# EAGLE design Signal_processing (EAGLE 9.5.1)
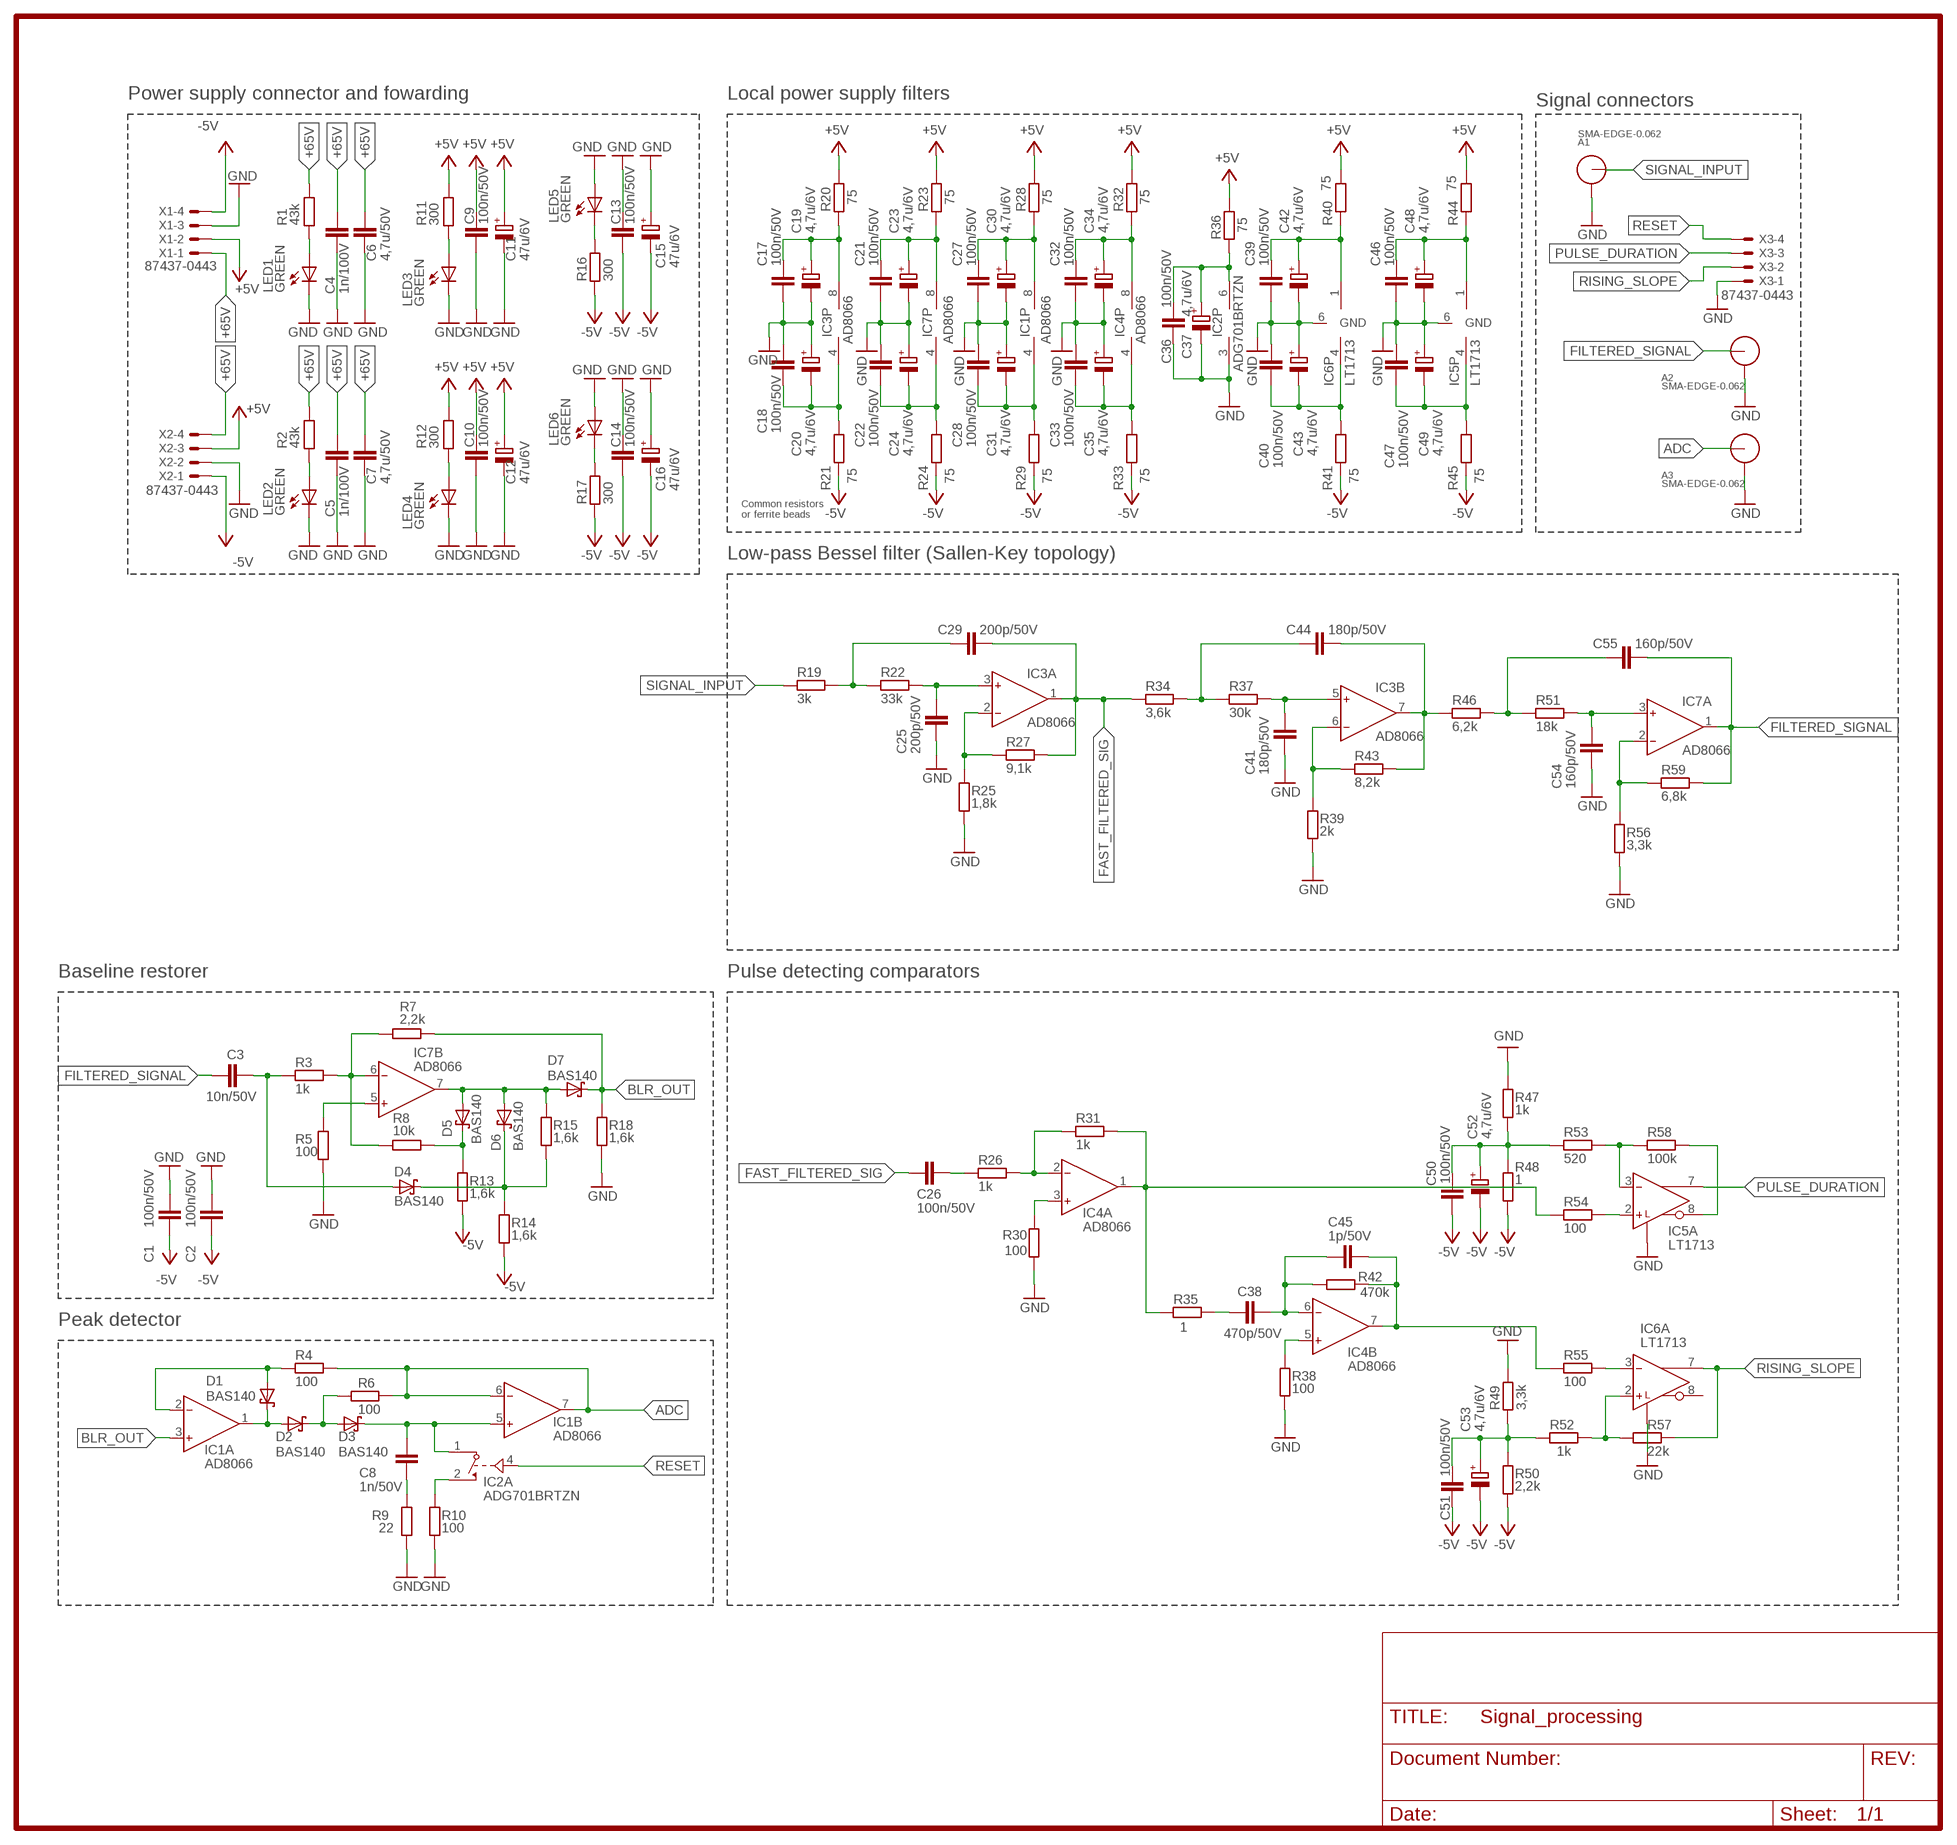
[diagram p0: schematic, sheet 1]

## Parts
A1  SMA-EDGE-0.062  LINX-SMA-EDGE-0.062  [CONSMA003.062]
A2  SMA-EDGE-0.062  LINX-SMA-EDGE-0.062  [CONSMA003.062]
A3  SMA-EDGE-0.062  LINX-SMA-EDGE-0.062  [CONSMA003.062]
C1  100n/50V  C-EUC0603  [C0603]
C2  100n/50V  C-EUC0603  [C0603]
C3  10n/50V  C-EUC0603  [C0603]
C4  1n/100V  C-EUC0603  [C0603]
C5  1n/100V  C-EUC0603  [C0603]
C6  4,7u/50V  C-EUC1206  [C1206]
C7  4,7u/50V  C-EUC1206  [C1206]
C8  1n/50V  C-EUC0603  [C0603]
C9  100n/50V  C-EUC0603  [C0603]
C10  100n/50V  C-EUC0603  [C0603]
C11  47u/6V  CPOL-EUSMCB  [SMC_B]
C12  47u/6V  CPOL-EUSMCB  [SMC_B]
C13  100n/50V  C-EUC0603  [C0603]
C14  100n/50V  C-EUC0603  [C0603]
C15  47u/6V  CPOL-EUSMCB  [SMC_B]
C16  47u/6V  CPOL-EUSMCB  [SMC_B]
C17  100n/50V  C-EUC0603  [C0603]
C18  100n/50V  C-EUC0603  [C0603]
C19  4,7u/6V  CPOL-EUSMCA  [SMC_A]
C20  4,7u/6V  CPOL-EUSMCA  [SMC_A]
C21  100n/50V  C-EUC0603  [C0603]
C22  100n/50V  C-EUC0603  [C0603]
C23  4,7u/6V  CPOL-EUSMCA  [SMC_A]
C24  4,7u/6V  CPOL-EUSMCA  [SMC_A]
C25  200p/50V  C-EUC0603  [C0603]
C26  100n/50V  C-EUC0603  [C0603]
C27  100n/50V  C-EUC0603  [C0603]
C28  100n/50V  C-EUC0603  [C0603]
C29  200p/50V  C-EUC0603  [C0603]
C30  4,7u/6V  CPOL-EUSMCA  [SMC_A]
C31  4,7u/6V  CPOL-EUSMCA  [SMC_A]
C32  100n/50V  C-EUC0603  [C0603]
C33  100n/50V  C-EUC0603  [C0603]
C34  4,7u/6V  CPOL-EUSMCA  [SMC_A]
C35  4,7u/6V  CPOL-EUSMCA  [SMC_A]
C36  100n/50V  C-EUC0603  [C0603]
C37  4,7u/6V  CPOL-EUSMCA  [SMC_A]
C38  470p/50V  C-EUC0603  [C0603]
C39  100n/50V  C-EUC0603  [C0603]
C40  100n/50V  C-EUC0603  [C0603]
C41  180p/50V  C-EUC0603  [C0603]
C42  4,7u/6V  CPOL-EUSMCA  [SMC_A]
C43  4,7u/6V  CPOL-EUSMCA  [SMC_A]
C44  180p/50V  C-EUC0603  [C0603]
C45  1p/50V  C-EUC0603  [C0603]
C46  100n/50V  C-EUC0603  [C0603]
C47  100n/50V  C-EUC0603  [C0603]
C48  4,7u/6V  CPOL-EUSMCA  [SMC_A]
C49  4,7u/6V  CPOL-EUSMCA  [SMC_A]
C50  100n/50V  C-EUC0603  [C0603]
C51  100n/50V  C-EUC0603  [C0603]
C52  4,7u/6V  CPOL-EUSMCA  [SMC_A]
C53  4,7u/6V  CPOL-EUSMCA  [SMC_A]
C54  160p/50V  C-EUC0603  [C0603]
C55  160p/50V  C-EUC0603  [C0603]
D1  BAS140  [SOD2514X100N]
D2  BAS140  [SOD2514X100N]
D3  BAS140  [SOD2514X100N]
D4  BAS140  [SOD2514X100N]
D5  BAS140  [SOD2514X100N]
D6  BAS140  [SOD2514X100N]
D7  BAS140  [SOD2514X100N]
IC1  AD8066  [MSOP8]
IC2  ADG701BRTZN  [SOT23-6]
IC3  AD8066  [MSOP8]
IC4  AD8066  [MSOP8]
IC5  LT1713  [MSOP8]
IC6  LT1713  [MSOP8]
IC7  AD8066  [MSOP8]
LED1  GREEN  LEDCHIPLED_0603  [CHIPLED_0603]
LED2  GREEN  LEDCHIPLED_0603  [CHIPLED_0603]
LED3  GREEN  LEDCHIPLED_0603  [CHIPLED_0603]
LED4  GREEN  LEDCHIPLED_0603  [CHIPLED_0603]
LED5  GREEN  LEDCHIPLED_0603  [CHIPLED_0603]
LED6  GREEN  LEDCHIPLED_0603  [CHIPLED_0603]
R1  43k  R-EU_R0603  [R0603]
R2  43k  R-EU_R0603  [R0603]
R3  1k  R-EU_R0603  [R0603]
R4  100  R-EU_R0603  [R0603]
R5  100  R-EU_R0603  [R0603]
R6  100  R-EU_R0603  [R0603]
R7  2,2k  R-EU_R0603  [R0603]
R8  10k  R-EU_R0603  [R0603]
R9  22  R-EU_R0603  [R0603]
R10  100  R-EU_R0603  [R0603]
R11  300  R-EU_R0603  [R0603]
R12  300  R-EU_R0603  [R0603]
R13  1,6k  R-EU_R0603  [R0603]
R14  1,6k  R-EU_R0603  [R0603]
R15  1,6k  R-EU_R0603  [R0603]
R16  300  R-EU_R0603  [R0603]
R17  300  R-EU_R0603  [R0603]
R18  1,6k  R-EU_R0603  [R0603]
R19  3k  R-EU_R0603  [R0603]
R20  75  R-EU_R0603  [R0603]
R21  75  R-EU_R0603  [R0603]
R22  33k  R-EU_R0603  [R0603]
R23  75  R-EU_R0603  [R0603]
R24  75  R-EU_R0603  [R0603]
R25  1,8k  R-EU_R0603  [R0603]
R26  1k  R-EU_R0603  [R0603]
R27  9,1k  R-EU_R0603  [R0603]
R28  75  R-EU_R0603  [R0603]
R29  75  R-EU_R0603  [R0603]
R30  100  R-EU_R0603  [R0603]
R31  1k  R-EU_R0603  [R0603]
R32  75  R-EU_R0603  [R0603]
R33  75  R-EU_R0603  [R0603]
R34  3,6k  R-EU_R0603  [R0603]
R35  1  R-EU_R0603  [R0603]
R36  75  R-EU_R0603  [R0603]
R37  30k  R-EU_R0603  [R0603]
R38  100  R-EU_R0603  [R0603]
R39  2k  R-EU_R0603  [R0603]
R40  75  R-EU_R0603  [R0603]
R41  75  R-EU_R0603  [R0603]
R42  470k  R-EU_R0603  [R0603]
R43  8,2k  R-EU_R0603  [R0603]
R44  75  R-EU_R0603  [R0603]
R45  75  R-EU_R0603  [R0603]
R46  6,2k  R-EU_R0603  [R0603]
R47  1k  R-EU_R0603  [R0603]
R48  1  R-EU_R0603  [R0603]
R49  3,3k  R-EU_R0603  [R0603]
R50  2,2k  R-EU_R0603  [R0603]
R51  18k  R-EU_R0603  [R0603]
R52  1k  R-EU_R0603  [R0603]
R53  520  R-EU_R0603  [R0603]
R54  100  R-EU_R0603  [R0603]
R55  100  R-EU_R0603  [R0603]
R56  3,3k  R-EU_R0603  [R0603]
R57  22k  R-EU_R0603  [R0603]
R58  100k  R-EU_R0603  [R0603]
R59  6,8k  R-EU_R0603  [R0603]
X1  87437-0443  87438-0487437-0443  [87437-0443]
X2  87437-0443  87438-0487437-0443  [87437-0443]
X3  87437-0443  87438-0487437-0443  [87437-0443]

## Nets
+5V: C9.2 C10.2 C11.+ C12.+ R11.2 R12.2 R20.1 R23.1 R28.1 R32.1 R36.1 R40.1 R44.1 X1.2 X1.6 X2.3 X2.7
+65V: C4.2 C5.2 C6.1 C7.1 R1.2 R2.2 X1.1 X1.5 X2.4 X2.8
-5V: C1.1 C2.1 C13.1 C14.1 C15.- C16.- C50.2 C51.2 C52.- C53.- R13.2 R14.2 R16.1 R17.1 R21.2 R24.2 R29.2 R33.2 R41.2 R45.2 R48.2 R50.2 X1.4 X1.8 X2.1 X2.5
ADC: A3.ANT IC1.6(B:IN-) IC1.7(B:OUT) R4.2 R6.2
BLR_OUT: D7.K IC1.3(A:IN+) R7.1 R18.1
FAST_FILTERED_SIG: C26.2 C29.1 IC3.1(A:OUT) R27.2 R34.1
FILTERED_SIGNAL: A2.ANT C3.2 C55.1 IC7.1(A:OUT) R59.2
GND: A1.GND1 A1.GND2 A1.GND3 A1.GND4 A2.GND1 A2.GND2 A2.GND3 A2.GND4 A3.GND1 A3.GND2 A3.GND3 A3.GND4 C1.2 C2.2 C4.1 C5.1 C6.2 C7.2 C9.1 C10.1 C11.- C12.- C13.2 C14.2 C15.+ C16.+ C17.1 C18.2 C19.- C20.+ C21.1 C22.2 C23.- C24.+ C25.1 C27.1 C28.2 C30.- C31.+ C32.1 C33.2 C34.- C35.+ C36.1 C37.- C39.1 C40.2 C41.1 C42.- C43.+ C46.1 C47.2 C48.- C49.+ C54.1 IC2.3(P:V-) IC5.5(A:L) IC5.6(GND:GND) IC6.5(A:L) IC6.6(GND:GND) LED1.C LED2.C LED3.C LED4.C LED5.A LED6.A R5.1 R9.1 R10.1 R18.2 R25.1 R30.1 R38.1 R39.1 R47.1 R49.1 R56.1 X1.3 X1.7 X2.2 X2.6 X3.1 X3.5
N$1: LED3.A R11.1
N$2: LED5.C R16.2
N$3: LED2.A R2.1
N$4: C18.1 C20.- IC3.4(P:V-) R21.1
N$5: LED4.A R12.1
N$6: C22.1 C24.- IC7.4(P:V-) R24.1
N$7: LED6.C R17.2
N$10: C29.2 R19.2 R22.1
N$11: C3.1 D4.A R3.1
N$12: IC7.6(B:IN-) R3.2 R7.2 R8.2
N$13: D5.A D6.A D7.A IC7.7(B:OUT) R15.1
N$14: D1.K D2.A IC1.1(A:OUT)
N$15: C25.2 IC3.3(A:IN+) R22.2
N$16: IC3.2(A:IN-) R25.2 R27.1
N$17: C27.2 C30.+ IC1.8(P:V+) R28.2
N$18: C21.2 C23.+ IC7.8(P:V+) R23.2
N$19: C44.2 R34.2 R37.1
N$20: D5.K R8.1 R13.1
N$21: C28.1 C31.- IC1.4(P:V-) R29.1
N$22: D4.K D6.K R14.1 R15.2
N$23: D1.A IC1.2(A:IN-) R4.1
N$24: C55.2 R46.2 R51.1
N$25: D2.K D3.A R6.1
N$26: IC7.5(B:IN+) R5.2
N$27: LED1.A R1.1
N$28: IC4.2(A:IN-) R26.2 R31.1
N$31: C8.1 D3.K IC1.5(B:IN+) IC2.1(A:D)
N$32: C41.2 IC3.5(B:IN+) R37.2
N$33: IC3.6(B:IN-) R39.2 R43.1
N$35: C8.2 R9.2
N$36: C54.2 IC7.3(A:IN+) R51.2
N$38: C17.2 C19.+ IC3.8(P:V+) R20.2
N$39: C36.2 C37.+ IC2.6(P:V+) R36.2
N$40: IC2.2(A:S) R10.2
N$41: C26.1 R26.1
N$42: C39.2 C42.+ IC6.1(P:V+) R40.2
N$43: IC4.5(B:IN+) R38.2
N$44: C40.1 C43.- IC6.4(P:V-) R41.1
N$45: C46.2 C48.+ IC5.1(P:V+) R44.2
N$46: C47.1 C49.- IC5.4(P:V-) R45.1
N$49: IC7.2(A:IN-) R56.2 R59.1
N$51: IC4.1(A:OUT) R31.2 R35.1 R54.1
N$52: IC4.3(A:IN+) R30.2
N$53: C38.2 R35.2
N$54: C38.1 C45.2 IC4.6(B:IN-) R42.1
N$55: C45.1 IC4.7(B:OUT) R42.2 R55.1
N$56: IC5.2(A:IN+) R54.2
N$57: IC6.2(A:IN+) R52.2 R57.1
N$58: C51.1 C53.+ R49.2 R50.1 R52.1
N$59: IC5.3(A:IN-) R53.2 R58.1
N$60: IC5.8(A:BOUT) R58.2
N$61: IC6.3(A:IN-) R55.2
N$62: C32.2 C34.+ IC4.8(P:V+) R32.2
N$63: C50.1 C52.+ R47.2 R48.1 R53.1
N$64: C33.1 C35.- IC4.4(P:V-) R33.1
N$99: C44.1 IC3.7(B:OUT) R43.2 R46.1
PULSE_DURATION: IC5.7(A:OUT) X3.3 X3.7
RESET: IC2.4(A:IN) X3.4 X3.8
RISING_SLOPE: IC6.7(A:OUT) R57.2 X3.2 X3.6
SIGNAL_INPUT: A1.ANT R19.1
Unconnected: IC6.8(A:BOUT)

## Notes on the sheet
- Power supply connector and fowarding | Local power supply filters
- Signal connectors
- Common resistors 
  or ferrite beads
- Low-pass Bessel filter (Sallen-Key topology)
- Baseline restorer | Pulse detecting comparators
- Peak detector

## Library data of the parts
A1-A3 = connector:LINX-SMA-EDGE-0.062: CONN SMA JACK 50 OHM EDGE MNT; DIGIKEY: CONSMA003.062-ND
C1-C3 C6-C10 C13 C14 C17 C18 C21 C22 C25-C29 C32 C33 C36 C38-C41 C44-C47 C50 C51 C54 C55 = rcl:C-EU: CAPACITOR, European symbol; SPICEPREFIX: C
C4 C5 = rcl:C-EU: CAPACITOR, European symbol
C11 C12 C15 C16 C19 C20 C23 C24 C30 C31 C34 C35 C37 C42 C43 C48 C49 C52 C53 = rcl:CPOL-EU: POLARIZED CAPACITOR, European symbol; SPICEPREFIX: C
D1-D7 = NXP_60_26022015:BAS140
IC1 IC3 IC4 IC7 = analog-devices:AD8066: High Performance, 145 MHz FastFET Op Amps Source: http://www.analog.com/static/imported-files/data_sheets/AD8065_8066.pdf
IC2 = ADG701BRTZ:ADG701BRTZ: ADG701BRTZ, Analogue SPST Switch Single SPST, 3, 5V, 6-Pin, SOT-23 Source: Datasheet <http://www.analog.com/static/imported-files/data_sheets/ADG701_702.pdf>
IC5 IC6 = analog-devices:LT1713
LED1-LED6 = led:LED: LED OSRAM: - CHIPLED LG R971, LG N971, LY N971, LG Q971, LY Q971, LO R971, LY R971 LH N974, LH R974 LS Q976, LO Q976, LY Q976 LO Q996 - Hyper CHIPLED LW Q18S LB Q993, LB Q99A, LB R99A - SideLED LS A670, LO A670, LY A670, LG A670, LP A670 LB A673, LV A673, LT A673, LW A673 LH A674 LY A675 LS A676, LA A676, LO A676, LY A676, LW A676 LS A679, LY A679, LG A679 - Hyper Micro SIDELED® LS Y876, LA Y876, LO Y876, LY Y876 LT Y87S - SmartLED LW L88C, LW L88S LB L89C, LB L89S, LG L890 LS L89K, LO L89K, LY L89K LS L896, LA L896, LO L896, LY L896 - TOPLED LS T670, LO T670, LY T670, LG T670, LP T670 LSG T670, LSP T670, LSY T670, LOP T670, LYG T670 LG T671, LOG T671, LSG T671 LB T673, LV T673, LT T673, LW T673 LH T674 LS T676, LA T676, LO T676, LY T676, LB T676, LH T676, LSB T676, LW T676 LB T67C, LV T67C, LT T67C, LS T67K, LO T67K, LY T67K, LW E67C LS E67B, LA E67B, LO E67B, LY E67B, LB E67C, LV E67C, LT E67C LW T67C LS T679, LY T679, LG T679 LS T770, LO T770, LY T770, LG T770, LP T770 LB T773, LV T773, LT T773, LW T773 LH T774 LS E675, LA E675, LY E675, LS T675 LS T776, LA T776, LO T776, LY T776, LB T776 LHGB T686 LT T68C, LB T68C - Hyper Mini TOPLED® LB M676 - Mini TOPLED Santana® LG M470 LS M47K, LO M47K, LY M47K Source: http://www.osram.convergy.de LUXEON: - LUMILED® LXK2-PW12-R00, LXK2-PW12-S00, LXK2-PW14-U00, LXK2-PW14-V00 LXK2-PM12-R00, LXK2-PM12-S00, LXK2-PM14-U00 LXK2-PE12-Q00, LXK2-PE12-R00, LXK2-PE12-S00, LXK2-PE14-T00, LXK2-PE14-U00 LXK2-PB12-K00, LXK2-PB12-L00, LXK2-PB12-M00, LXK2-PB14-N00, LXK2-PB14-P00, LXK2-PB14-Q00 LXK2-PR12-L00, LXK2-PR12-M00, LXK2-PR14-Q00, LXK2-PR14-R00 LXK2-PD12-Q00, LXK2-PD12-R00, LXK2-PD12-S00 LXK2-PH12-R00, LXK2-PH12-S00 LXK2-PL12-P00, LXK2-PL12-Q00, LXK2-PL12-R00 Source: www.luxeon.com KINGBRIGHT: KA-3528ASYC Source: www.kingbright.com
R1-R59 = rcl:R-EU_: RESISTOR, European symbol; SPICEPREFIX: R
X1-X3 = con-molex:87438-04: Wire-to-Board 1.50mm (.059") Pitch Header - Right Angle, SMT, Shrouded Source: http://www.molex.com/product/micro/87438.html

## Board
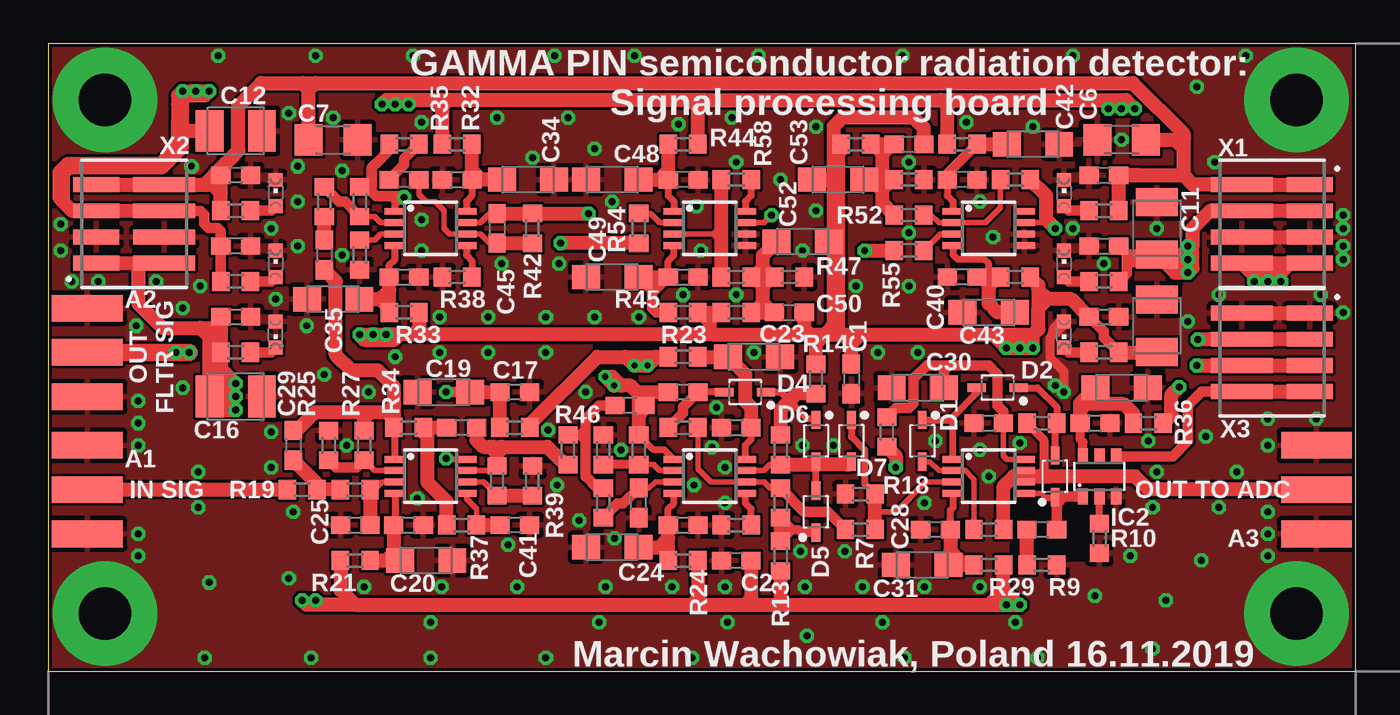
[diagram p1: board, top side]
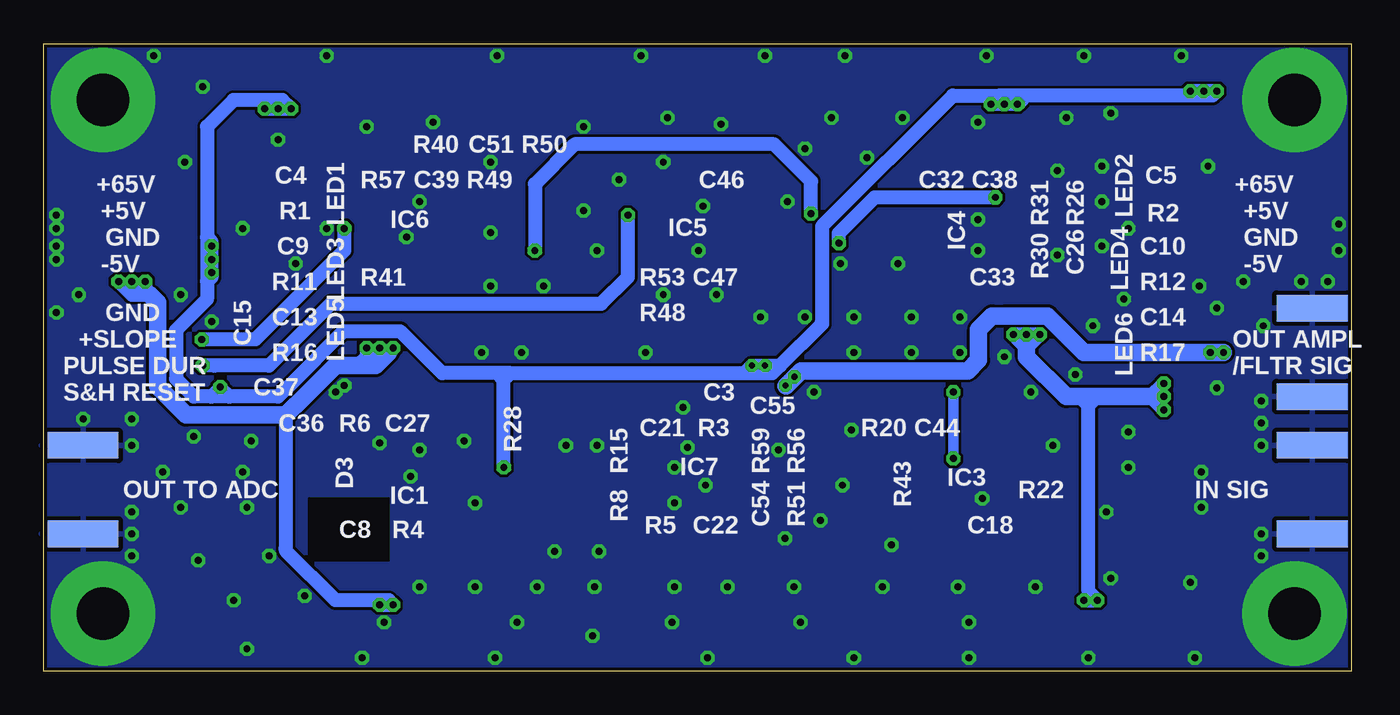
[diagram p2: board, bottom side, seen from below]

Size 75 x 36 mm. Coordinates in mm from the lower left corner, seen from the top.
Outline: 0,0 75,0 75,36 0,36 0,0
Copper layers (1*16): Top 0.035mm / dielectric 1.5mm / Bottom 0.035mm
Design rules "JLCPCB *": minimum track width 6mil, minimum drill 0.2mm, track to track 6mil, track to pad 6mil, pad to pad 6mil, via to via 6mil, smd to smd 6mil, copper to edge 8mil, drill to drill 6mil, minimum pad ring 10mil, minimum via ring 8mil, stop-mask expansion 4mil, vias tented up to drill 20mil, thermal gap 10mil

### Footprints (pad centres in the part's own frame; a part is rotated, then mirrored left to right if it is on the bottom)
CONSMA003.062 = smd 4.06 x 1.52: ANT 0,0; GND1 0,2.54; GND2 0,-2.54 | smd 4.06 x 1.52 bottom: GND3 0,2.54; GND4 0,-2.54
C0603 = smd 1.1 x 1: 1 -0.85,0; 2 0.85,0
C1206 = smd 1.6 x 1.8: 1 -1.4,0; 2 1.4,0
SMC_B = smd 1.6 x 2.4: + -1.5,0; - 1.5,0
SMC_A = smd 1.6 x 1.4: + -1.5,0; - 1.5,0
SOD2514X100N = smd 1.05 x 0.5: A 1.2,0; K -1.2,0
MSOP8 = smd 0.4 x 1.2: 1 -0.975,-2.05; 2 -0.325,-2.05; 3 0.325,-2.05; 4 0.975,-2.05; 5 0.975,2.05; 6 0.325,2.05; 7 -0.325,2.05; 8 -0.975,2.05
SOT23-6 = smd 0.6 x 0.9: 1 -0.95,-1.15; 2 0,-1.15; 3 0.95,-1.15; 4 0.95,1.15; 5 0,1.15; 6 -0.95,1.15
CHIPLED_0603 = smd 0.8 x 0.8: A 0,-0.75; C 0,0.75
R0603 = smd 1 x 1.1: 1 -0.85,0; 2 0.85,0
87437-0443 = smd 2.65 x 0.85: 1 0,2.25; 2 0,0.75; 3 0,-0.75; 4 0,-2.25 | smd 3.55 x 0.85: 5 -3.9,2.25; 6 -3.9,0.75; 7 -3.9,-0.75; 8 -3.9,-2.25

### Placement (x,y rotation side)
A1  2.25,10.41 0 top
A2  2.25,18.29 0 top
A3  72.74,10.41 0 top
C1  46.07,16.76 270 top
C2  39.46,6.35 180 top
C3  36.42,16 180 top
C4  60.55,28.45 0 top
C5  10.76,28.45 180 top
C6  61.56,30.48 180 top
C7  16.35,30.48 0 top
C8  56.99,8.13 180 top
C9  60.55,24.38 0 top
C10  10.76,24.38 180 top
C11  63.59,25.4 90 top
C12  10.76,30.99 0 top
C13  60.55,20.32 0 top
C14  10.76,20.32 0 top
C15  63.59,19.81 270 top
C16  10.76,15.75 180 top
C17  26.76,16 180 top
C18  20.67,8.38 0 top
C19  22.7,16 180 top
C20  21.68,6.35 180 top
C21  39.46,13.97 0 top
C22  36.42,8.38 0 top
C23  40.48,18.03 0 top
C24  32.35,7.11 0 top
C25  17.62,8.38 0 top
C26  15.84,23.88 270 top
C27  53.94,14.22 0 top
C28  50.89,8.13 180 top
C29  14.06,12.95 270 top
C30  49.88,16.26 180 top
C31  50.13,6.1 0 top
C32  23.46,28.19 0 top
C33  20.41,22.61 0 top
C34  27.53,28.19 0 top
C35  16.35,21.34 0 top
C36  60.04,14.22 180 top
C37  61.56,16.26 0 top
C38  20.41,28.19 180 top
C39  52.42,28.19 180 top
C40  52.42,22.61 180 top
C41  26.76,8.38 180 top
C42  56.48,30.23 0 top
C43  53.94,20.57 0 top
C44  23.72,13.97 180 top
C45  25.75,25.4 270 top
C46  36.42,28.19 180 top
C47  36.42,22.61 0 top
C48  32.35,28.19 180 top
C49  32.35,22.61 0 top
C50  42.51,20.57 0 top
C51  49.37,30.23 0 top
C52  43.27,24.64 0 top
C53  45.31,28.19 180 top
C54  33.88,9.65 90 top
C55  33.37,15.24 180 top
D1  50.13,13.21 270 top
D2  54.45,16.26 180 top
D3  57.75,11.18 90 top
D4  39.97,16 180 top
D5  44.04,9.14 90 top
D6  44.04,13.21 270 top
D7  46.07,13.21 270 top
IC1  53.94,11.18 270 top
IC2  60.29,11.18 0 top
IC3  21.94,11.18 270 top
IC4  21.94,25.4 270 top
IC5  37.94,25.4 270 top
IC6  53.94,25.4 270 top
IC7  37.94,11.18 270 top
LED1  58.26,27.43 0 top
LED2  13.05,27.43 0 top
LED3  58.26,23.37 0 top
LED4  13.05,23.37 0 top
LED5  58.26,19.3 180 top
LED6  13.05,19.3 180 top
R1  60.55,26.42 0 top
R2  10.76,26.42 180 top
R3  36.42,13.97 0 top
R4  53.94,8.13 0 top
R5  39.46,8.38 0 top
R6  56.99,14.22 180 top
R7  46.58,8.13 180 top
R8  42,9.65 90 top
R9  56.99,6.1 180 top
R10  60.29,7.62 90 top
R11  60.55,22.35 0 top
R12  10.76,22.35 180 top
R13  42,6.6 270 top
R14  44.04,16.76 90 top
R15  42,12.7 90 top
R16  60.55,18.29 180 top
R17  10.76,18.29 0 top
R18  46.58,10.16 180 top
R19  14.57,10.41 0 top
R20  1  [R0603]  26.76,13.97 180 top
R21  1  [R0603]  17.62,6.35 180 top
R22  17.62,10.41 0 top
R23  1  [R0603]  36.42,18.03 0 top
R24  1  [R0603]  36.42,6.35 0 top
R25  16.1,12.95 270 top
R26  15.84,26.92 90 top
R27  18.13,12.95 90 top
R28  1  [R0603]  48.1,13.72 90 top
R29  1  [R0603]  53.94,6.1 0 top
R30  17.87,23.88 90 top
R31  17.87,26.92 90 top
R32  1  [R0603]  23.46,30.23 0 top
R33  1  [R0603]  20.41,20.57 0 top
R34  20.67,13.97 0 top
R35  20.41,30.23 0 top
R36  1  [R0603]  63.09,14.22 180 top
R37  23.72,8.38 0 top
R38  23.46,22.61 0 top
R39  27.78,10.92 270 top
R40  1  [R0603]  52.42,30.23 0 top
R41  1  [R0603]  55.47,22.61 0 top
R42  27.78,25.4 90 top
R43  25.75,10.92 90 top
R44  1  [R0603]  36.42,30.23 180 top
R45  1  [R0603]  36.42,20.57 0 top
R46  29.81,12.7 90 top
R47  42.51,22.61 180 top
R48  39.46,20.57 180 top
R49  49.37,28.19 180 top
R50  46.32,30.23 180 top
R51  31.84,9.65 270 top
R52  49.37,26.16 0 top
R53  39.46,22.61 180 top
R54  33.88,25.4 90 top
R55  49.37,24.13 0 top
R56  31.84,12.7 270 top
R57  55.47,28.19 0 top
R58  39.46,28.19 0 top
R59  33.88,12.7 90 top
X1  72.36,25.65 0 top
X2  2.76,25.65 180 top
X3  72.36,18.29 0 top

### Tracks (layer width: path | path; a pad name or v marks a point on that pad's centre or on a via)
+5V  (via drill 0.35, 0.4)
  Top 0.61: R12.2 C10.2 9.91,25.23 9.74,25.41 9.22,25.41 8.96,25.68 8.96,26.19 8.74,26.4 X2.7 | 63.57,23.88 62.58,23.88 62.58,23.53 | C9.2 61.86,23.92 | 61.86,23.62 61.86,22.82 R11.2 | 61.86,23.62 61.86,23.92 | 61.86,23.92 61.88,23.9 C11.+ 63.15,23.46 62.03,23.46 61.86,23.62
  Top 0.813: R28.1 48.61,12.36 v48.61,11.68 | 37.69,32.77 36.85,32.77 | 36.85,32.77 22.95,32.77 | 22.95,32.77 22.27,32.77 | R44.1 37.27,32.35 | 37.27,32.35 37.69,32.77 | 37.27,32.35 36.85,32.77 | 7.46,30.48 7.46,29.97 | 7.46,30.48 7.46,31.5 | C12.+ 7.97,30.99 | 7.97,30.99 7.46,30.48 | 7.97,30.99 7.46,31.5 | R32.1 22.61,32.42 | 22.61,32.42 22.95,32.77 | 22.61,32.42 22.27,32.77 | 37.69,32.77 51.23,32.77 | 51.23,32.77 51.91,32.77 | R40.1 51.57,32.42 | 51.57,32.42 51.91,32.77 | 51.57,32.42 51.23,32.77 | C11.+ 64.13,23.9 | 68.47,26.42 66.64,26.42 | 63.57,23.88 C11.+ | R36.1 64.42,14.71 64.42,15.86 v64.86,16.3 | C11.+ 64.33,23.9 | C11.+ 65.09,23.9 65.09,23.14 v65.37,22.86 | C11.+ 64.63,22.86 v65.37,22.86 | 66.64,26.42 65.63,25.4 65.63,24.38 | C11.+ 65.14,23.9 65.63,24.38 | 66.65,26.4 66.64,26.42 | 51.91,32.77 61.82,32.77 v62.32,32.26 | 7.46,32.51 7.46,33.02 v7.71,33.27 | 7.46,32.51 7.46,31.5 | 22.27,32.77 19.4,32.77 v19.14,32.51 | v8.48,33.27 8.22,33.02 8.98,33.02 v9.24,33.27 v8.48,33.27 | 7.46,32.51 7.59,32.64 8.22,33.27 v8.48,33.27 | 0.76,27.2 0.76,27.03 1.39,26.4 X2.3 X2.7 | v65.37,22.86 65.63,23.11 65.63,24.38 | v65.37,24.38 v65.37,23.62 | 33.11,18.03 34.89,18.03 | 34.89,18.03 R23.1 | R20.1 27.71,14.06 27.71,14.24 31.5,18.03 33.11,18.03 | 33.11,18.03 v33.62,17.53 v34.38,17.53 34.89,18.03 | X1.6 68.47,26.42 | 68.47,26.42 68.67,26.42 | X1.2 68.48,26.4 68.47,26.42
  Top 1.016: 7.59,32.64 7.59,30.1 | 7.46,29.97 6.48,28.99 1.15,28.99 0.76,28.6 0.76,27.2
  Bottom 0.813: v62.32,32.26 v61.56,32.26 v60.8,32.26 61.31,32.77 64.1,32.77 65.63,31.24 65.63,24.89 | 18.89,33.02 7.97,33.02 v7.71,33.27 v9.24,33.27 | 18.89,33.02 18.89,32.77 v19.14,32.51 v19.91,32.51 v20.67,32.51 20.16,33.02 | 18.89,33.02 20.16,33.02 | 20.16,33.02 22.86,33.02 30.36,25.52 30.36,19.94 30.37,19.92 | 64.36,15.75 61.56,15.75 61,16.31 60.99,16.31 57.79,19.51 54.56,19.51 52.14,17.09 48.99,17.09 | 64.36,15.75 65.37,15.75 | 65.37,15.75 66.39,15.75 67.4,16.76 67.4,19.56 65.63,21.34 65.63,22.35 | 64.86,16.26 65.37,15.75 | v64.86,16.3 64.86,16.26 | 64.86,16.26 64.36,15.75 | 48.23,17.09 48.99,17.09 | 65.63,24.89 65.63,22.35 | 65.63,24.89 65.37,24.64 v65.37,24.38 v65.37,22.86 65.37,22.61 65.63,22.35 | v48.61,11.68 48.61,16.71 | 48.61,16.71 48.99,17.09 | 48.61,16.71 48.23,17.09 | 30.37,19.92 30.37,20.01 | 48.23,17.09 34.82,17.09 | 34.82,17.09 33.2,17.09 32.81,17.48 | 32.81,17.48 32.77,17.53 | 32.77,17.53 30.37,19.92 | v33.62,17.53 33.58,17.48 32.81,17.48 | 32.77,17.53 v34.38,17.53 34.82,17.09
+65V
  Top 0.152: C6.1 63.22,30.73
  Top 0.813: 8.97,27.9 9.37,27.9 | 9.37,27.9 C5.2 | R2.2 9.91,27.43 | 9.91,27.43 C5.2 | 9.37,27.9 9.44,27.9 9.91,27.43 | 65.12,28.45 65.66,27.9 X1.5 X1.1 | R1.2 C4.2 | 62.58,28.45 C4.2 | C4.2 65.12,28.45 | 65.12,28.45 65.12,29.97 | 65.12,29.97 65.12,30.48 | C6.1 64.61,30.48 | 64.61,30.48 65.12,30.48 | 64.61,30.48 65.12,29.97 | 9.91,28.85 10.62,29.56 10.62,29.58 10.9,29.86 10.9,32.42 12.21,33.73 14.57,33.73 | 9.91,28.85 8.97,27.9 | C5.2 9.91,28.85 | 65.12,30.48 65.12,30.83 62.22,33.73 15.33,33.73 | 14.57,33.73 15.33,33.73 | C7.1 14.95,33.35 | 14.95,33.35 14.57,33.73 | 14.95,33.35 14.96,33.35 15.33,33.73 | X2.4 X2.8 8.97,27.9
-5V  (via drill 0.4)
  Top 0.152: 56.48,22.61 R41.2
  Top 0.61: C13.1 60.55,19.47 60.55,19.14 R16.1
  Top 0.813: R24.2 37.27,4.15 | C2.1 40.31,4.15 39.97,3.81 | 39.97,3.81 41.75,3.81 | 41.75,3.81 42.26,3.81 | 42.26,3.81 53.94,3.81 | 54.79,4.66 R29.2 | 53.94,3.81 54.79,4.66 | 17.62,3.81 36.92,3.81 | 36.92,3.81 37.61,3.81 | 37.61,3.81 39.97,3.81 | R21.2 16.77,4.66 17.62,3.81 | 37.27,4.15 36.92,3.81 | 37.27,4.15 37.61,3.81 | R13.2 42,4.06 | 42,4.06 41.75,3.81 | 42,4.06 42.26,3.81 | R45.2 37.43,20.57 | 37.43,20.57 R48.2 | 37.43,20.57 37.94,20.07 37.94,19.56 38.19,19.3 | 38.19,19.3 43.02,19.3 | 43.02,19.3 43.7,19.3 | 43.7,19.3 44.54,19.3 | C50.2 43.36,19.65 | 43.36,19.65 43.02,19.3 | 43.36,19.65 43.7,19.3 | R14.2 44.04,18.8 | 44.04,18.8 44.54,19.3 | 44.04,18.8 44.04,18.97 43.7,19.3 | 44.54,19.3 45.05,19.3 | 45.05,19.3 45.56,19.3 | 45.56,19.3 46.58,19.3 | C1.1 46.07,18.8 | 46.07,18.8 46.58,19.3 | 46.07,18.8 45.56,19.3 | C13.1 58.68,21.34 57.31,21.34 | R16.1 63.85,18.29 | 63.85,18.29 64.1,18.03 | 63.85,18.29 63.82,18.31 C15.- | 46.58,19.3 54.2,19.3 | 54.2,19.3 55.21,19.3 | 55.21,19.3 55.47,19.3 | 55.47,19.3 56.48,19.3 | 38.19,19.3 21.43,19.3 | 21.43,19.3 20.92,19.3 | R33.2 21.26,19.65 | 21.26,19.65 21.26,19.47 21.43,19.3 | 20.92,19.3 21.26,19.65 | 45.47,19.39 45.56,19.3 | 45.31,28.57 45.31,29.72 45.47,29.88 R50.2 45.05,30.65 | 45.31,28.57 45.31,27.81 | 45.31,27.81 45.31,24.64 | 45.31,24.64 45.31,19.56 45.05,19.3 | C53.- 44.93,28.19 | 44.93,28.19 45.31,28.57 | 44.93,28.19 45.31,27.81 | C52.- 45.31,24.64 | C51.2 50.22,31.15 49.62,31.75 45.56,31.75 45.05,31.24 45.05,30.65 | 45.05,30.65 45.05,19.81 44.54,19.3 | C14.1 9.91,19.69 | 9.91,19.69 9.91,19.3 | 9.91,19.3 9.91,18.8 | 9.91,18.8 R17.1 9.91,17.36 v10.76,16.51 | 9.91,18.8 9.49,19.22 9.49,19.3 | 9.91,19.3 9.49,19.3 | 9.49,19.3 9.87,19.69
  Top 0.813: 9.87,19.69 9.91,19.69 | C16.- 9.26,17.02 10.27,16.01 | 10.27,16.01 10.53,15.75 v10.76,15.75 | C16.- 10.02,14.99 v10.76,14.99 10.27,15.48 10.27,16.01 | v69.18,22.35 v70.71,22.35 70.71,22.86 71.21,23.37 | v69.94,22.35 69.94,23.11 | 69.94,23.11 69.94,23.28 | v69.18,22.35 69.94,23.11 | v69.18,22.35 69.18,22.86 | 54.2,19.3 v54.96,18.54 | v54.96,18.54 55.21,18.8 55.21,19.3 | v55.72,18.54 55.47,18.8 55.47,19.3 | 56.48,19.3 v56.48,18.54 v55.72,18.54 | v54.96,18.54 v55.72,18.54 | 20.92,19.3 20.16,19.3 | 20.16,19.3 v19.4,19.3 v18.64,19.3 | 19.91,19.3 v17.87,19.3 17.87,19.25 18.13,19 19.85,19 20.16,19.3 | 17.62,3.81 15.59,3.81 | 15.59,3.81 v15.33,4.06 | 15.59,3.81 14.83,3.81 v14.57,4.06 | 8.73,19.69 6.57,19.69 5.17,21.08 5.17,23.11 4.88,23.4 | 8.73,19.69 9.87,19.69 | C16.- 9.26,19.15 8.73,19.69 | 56.48,19.32 56.48,19.3 | R41.2 56.8,22.12 56.8,21.84 | 56.8,21.84 56.8,20.83 | 57.31,21.34 56.8,20.83 | 57.31,21.34 56.8,21.84 | 56.48,19.3 56.8,19.62 56.8,20.83 | 53.94,3.81 v55.72,3.81 55.64,3.81 54.79,4.66 | X1.4 X1.8 69.18,22.68 v69.18,22.35 | X2.1 4.88,23.4 | X2.5 4.88,23.4
  Bottom 0.813: v10.76,15.75 11.52,15.75 | v10.76,16.51 11.52,15.75 | v10.76,14.99 11.52,15.75 | 56.99,17.53 55.97,17.53 v55.72,18.54 | 58.26,17.53 56.99,17.53 | v56.48,18.54 56.48,18.03 56.99,17.53 | v70.71,22.35 69.94,21.59 68.93,21.59 69.18,21.84 v69.18,22.35 | v69.94,22.35 69.94,22.1 69.44,21.59 | 19.02,18.92 18.64,18.54 v17.87,19.3 v19.4,19.3 19.02,18.92 | 19.02,18.92 v18.64,19.3 | v15.33,4.06 v14.57,4.06 15.08,4.57 15.08,15.24 | 15.08,15.24 15.59,15.75 | 15.08,15.24 14.57,15.75 | 55.21,18.29 v54.96,18.54 | v55.72,3.81 v54.96,3.81 55.21,4.06 58.26,4.06 61.11,6.91 61.11,7 61.12,7.02 61.12,14.68
  Bottom 1.016: 11.52,15.75 14.57,15.75 15.59,15.75 16.35,15.75 18.64,18.03 18.64,18.54 | 68.93,21.59 68.47,21.13 68.47,16.32 66.83,14.68 61.12,14.68 60.56,15.24 60.55,15.24 58.26,17.53 55.97,17.53 55.21,18.29
ADC
  Top 0.305: R4.2 54.87,8.2
  Top 0.406: IC1.7 55.99,11.19 55.97,11.18 55.99,11.16 IC1.6
  Top 0.508: R6.2 57.1,13.27 57.1,11.54 | 57.1,11.54 56.74,11.18 | 57.1,11.54 57.45,11.18 57.5,11.18
  Top 0.813: R4.2 54.79,10.59 55.38,11.18 55.97,11.18 56.74,11.18 57.5,11.18 62.32,11.18 63.09,10.41 A3.ANT
BLR_OUT
  Top 0.305: IC1.3 50.32,10.85 48.61,9.14 47.43,9.14
  Top 0.406: R18.1 46.83,10.76 46.83,12.7 46.07,13.46 D7.K
  Top 0.813: R7.1 47.43,9.14 R18.1
FAST_FILTERED_SIG
  Top 0.406: IC3.1 19.89,13.9 R34.1
  Top 0.813: C29.1 14.26,13.8 15.31,14.86 18.51,14.86 | 19.82,14.48 R34.1 19.84,13.99 19.84,16.32 18.89,17.27 17.37,17.27 16.49,18.15 16.49,22.38 C26.2 | 19.82,14.48 19.82,15.24 19.81,15.24 19.61,15.04 | 19.43,14.86 19.61,14.69 | 19.61,14.69 19.82,14.48 | 18.51,14.86 19.43,14.86 | R27.2 18.13,14.48 18.51,14.86 | 19.43,14.86 19.61,15.04 | 19.61,14.69 19.61,15.04
FILTERED_SIGNAL  (via drill 0.35, 0.4)
  Top 0.406: R59.2 34.73,12.7 35.34,12.7 IC7.1
  Top 0.813: 33.78,16 C3.2 | R59.2 33.88,14.73 | 33.88,15.49 34.13,15.24 C55.1 34.22,15.07 33.88,14.73 | 33.88,14.73 33.88,15.91 33.78,16 | 33.78,16 33.4,16.38 32.86,16.38 | 32.86,16.38 v32.46,16.38 v31.95,16.89 32.35,16.89 32.86,16.38
  Top 1.016: A2.ANT v8.09,18.29
  Bottom 0.813: v8.09,18.29 v7.33,18.29 | v32.46,16.38 32.43,16.36
  Bottom 1.016: v7.33,18.29 15.35,18.29 17.43,20.37 19.84,20.37 20.62,20.37 21.38,19.61 21.38,17.85 22,17.22 31.56,17.22 32.43,16.36
GND  (via drill 0.4, 3 pad 6)
  Top 0.508: LED5.A 58.26,19.93 | v58.26,16 58.26,17.18 57.45,17.99 57.45,19.13 57.61,19.29 57.61,19.41 57.77,19.56
  Top 0.813: v8.22,28.96 8.29,28.89 | 57.77,19.56 LED5.A | X3.5 X3.1 | X1.7 X1.3
  other vias: 3.27,3.3 71.59,3.3 71.59,32.77 3.27,32.77 1.36,22.35 2.89,22.35 5.17,15.49 5.17,12.95 5.17,14.22 5.17,7.87 5.17,6.6 69.94,7.87 69.94,12.95 72.74,14.48 69.94,14.48 69.94,9.14 69.94,6.6 74.26,26.16 74.26,25.4 74.26,24.38 74.26,23.62 74.26,20.57 72.99,21.59 67.15,21.59 65.37,20.07 52.67,31.5 56.48,31.24 54.2,24.89 63.59,25.4 66.9,29.21 53.43,26.92 58.77,25.4 44.04,31.24 39.21,31.75 39.46,29.21 42,28.19 39.46,21.59 36.42,21.59 33.88,20.32 28.54,20.32 29.3,23.37 22.45,20.32 25.24,20.32 21.43,25.91 21.43,24.13 9.75,35.31 13.81,32 14.32,28.96 14.32,26.92 14.32,24.38 14.83,19.81 16.35,31.75 16.86,28.7 21.43,31.5 0.73,25.65 0.73,24.13 6.19,22.35 8.73,22.1 13.05,21.34 7.71,20.83 12.79,13.72 12.79,11.68 8.6,11.43 15.84,17.02 22.45,18.29 25.24,18.29 28.54,18.29 21.18,9.91 18.13,4.83 14.06,9.14 13.81,5.33 8.98,0.76 15.08,0.76 15.33,35.31 29.05,35.31 33.62,35.31 40.73,35.31 48.99,35.31 58.77,35.31 68.67,35.31 21.94,0.76 28.54,0.76 36.92,0.76 49.12,0.76 43.53,2.03 56.74,0.76 63.34,1.27 67.15,9.4 29.81,31.75 25.75,31.75 36.16,31.37 68.17,11.43 63.34,9.4 62.07,6.6 60.04,4.32 55.47,2.79 53.43,4.83 53.43,12.7 53.94,11.18 47.59,18.29 49.88,18.29 50.89,13.21 45.05,12.95 43.27,12.95 40.48,18.29 38.32,15.11 38.07,12.83 38.83,11.68 37.05,10.67 38.83,9.65 43.15,6.86 45.69,6.86 43.4,4.83 46.7,4.83 50.26,4.83 50.26,9.65 38.83,4.83 35.78,4.83 31.97,4.83 26.89,4.83 22.57,4.83 29.18,10.67 30.45,8.64 26.38,7.24 8.6,9.4 16.86,23.88 17.11,12.95 60.55,23.37 63.09,13.21 32.86,12.7 57.75,16.38 28.67,13.84 18.38,16 19.91,18.03 32.48,7.62 55.72,13.08 63.59,11.43 26,23.37 27.78,29.46 66.13,6.35 9.24,5.08 5.05,19.81 12.79,25.4 49.37,29.21 61.56,30.48 64.1,4.06 38.96,2.79 31.59,2.79 21.94,2.79 47.85,2.79 65.88,33.53 7.71,16.26 30.83,16 66.39,13.46 20.92,35.31 31.34,29.97 44.04,26.42 43.27,24.13 46.32,22.1 49.37,22.1 32.35,26.92 49.37,25.15 31.34,20.32 37.43,24.13 37.18,26.67
  pour Top: 0.09,36.07 75.02,36.07 75.02,0 0.09,0
  pour Bottom: 0.09,36.07 75.28,36.07 75.28,0 0.09,0
N$1
  Top 0.61: LED3.A 58.53,22.35 R11.1
N$2
  Top 0.61: LED5.C 58.53,18.29 R16.2
N$3
  Top 0.61: R2.1 12.78,26.42 LED2.A
N$4
  Top 0.152: C18.1 19.82,8.13 19.89,8.2
  Top 0.406: IC3.4 19.89,8.45 C18.1
  Top 0.813: R21.1 19.4,6.35 | 19.4,6.35 C20.- | C18.1 19.82,6.77 19.4,6.35
N$5
  Top 0.61: R12.1 12.78,22.35 LED4.A
N$6
  Top 0.152: 35.57,10.13 IC7.4
  Top 0.406: C22.1 35.57,9.31 35.89,9.63 IC7.4
  Top 0.813: R24.1 35.57,7.11 | 35.57,7.11 35.57,7.62 | 35.57,7.62 C22.1 | C24.- 35.06,7.11 | 35.06,7.11 35.57,7.11 | 35.06,7.11 35.57,7.62
N$7
  Top 0.61: LED6.C 12.78,18.29 R17.2
N$8
  cutout Top: 55.21,9.91 59.78,9.91 59.78,6.35 55.21,6.35
  cutout Bottom: 55.21,9.91 59.78,9.91 59.78,6.35 55.21,6.35
N$10
  Top 0.152: 14.06,11.77 C29.2
  Top 0.813: R22.1 R19.2 15.42,10.75 C29.2
N$11
  Top 0.406: D4.A C3.1
  Top 0.61: C3.1 36.42,15.15 36.42,14.82 R3.1
N$12
  Top 0.305: R3.2 37.27,11.6 38.01,10.85 IC7.6 41.06,10.85 41.41,10.5 R8.2
  Top 0.61: R8.2 43.36,9.14 44.71,9.14 R7.2
N$13
  Top 0.305: IC7.7 41.06,11.5 41.41,11.85 R15.1
  Top 0.406: D6.A 44.04,11.85 | D5.A 44.04,11.47 43.66,11.85 | D7.A 45.91,11.85
  Top 0.813: R15.1 43.66,11.85 44.04,11.85 45.81,11.85 45.91,11.85
N$14
  Top 0.406: IC1.1 51.89,14.22 | D1.K 51.71,14.41 | 51.71,14.41 51.89,14.22 | 51.89,14.59 51.89,14.22 | 51.71,14.41 51.89,14.59 | 51.89,14.59 53.25,15.95 D2.A
N$15
  Top 0.152: IC3.3 19.67,10.88 | 18.72,10.41 R22.2
  Top 0.305: IC3.3 19.16,10.85 18.72,10.41
  Top 0.813: R22.2 C25.2
N$16
  Top 0.152: 18.38,11.68 18.38,11.85 | 18.38,11.85 18.21,12.02 | 18.48,11.76 18.38,11.85
  Top 0.305: IC3.2 18.73,11.5 R27.1
  Top 0.61: R25.2 16.52,11.68 17.71,11.68 R27.1
  Top 0.813: R27.1 18.21,12.02
N$17
  Top 0.305: 54.96,13.97 55.05,13.97 C27.2 54.79,12.36 55,12.15 IC1.8
  Top 0.61: R28.2 48.63,15.1 49.37,15.1 49.63,15.37 49.63,16.77 50.39,17.53 51.15,17.53 | C27.2 54.79,14.9 54.45,15.24 54.45,17.02 53.94,17.53 51.66,17.53 | 51.15,17.53 51.66,17.53 | 51.15,17.53 51.38,17.3 C30.+ 51.38,17.25 51.66,17.53
N$18
  Top 0.406: C21.2 40.31,13.3 39.97,12.95 39.97,12.17 IC7.8
  Top 0.813: R23.2 C23.+ 39.97,17.04 39.97,16 | C21.2 40.31,15.15 39.97,15.49 39.97,16 | 39.97,16
N$19
  Top 0.813: 21.68,13.97 R34.2 21.52,13.71 21.76,13.46 | 21.68,13.97 C44.2 | R37.1 22.87,9.73 21.76,10.84 21.76,13.46 | 21.68,13.97 21.76,13.89 21.76,13.46
N$20
  Top 0.508: D5.K 43.2,7.94 43.02,8.13 42.68,8.13 | 42,8.13 42.68,8.13 | R8.1 42.68,8.13 | R13.1 42.68,8.13
  Top 0.813: R8.1 42,8.13 R13.1
N$21
  Top 0.406: IC1.4 51.89,9.38 51.74,9.23 C28.1
  Top 0.813: C28.1 51.74,6.86 52.51,6.1 | R29.1 52.51,6.1 | 52.51,6.1 C31.-
N$22
  Top 0.406: D4.K 42,16 42.26,15.75 | 42.26,15.75 42.51,15.49 42.77,15.24 | 42.26,15.75 42.26,15.24 42.77,15.24 | D6.K 43.97,14.48 43.53,14.48 42.77,15.24 | 43.02,15.91 42.77,15.66 42.77,15.24 | 42.77,15.75 42.26,15.75
  Top 0.813: R15.2 42,14.99 42.26,15.24 42.51,15.49 42.77,15.75 42.93,15.91 43.02,15.91 R14.1
N$23
  Top 0.305: D1.A 50.57,12.01 51.08,11.5 IC1.2 52.6,11.5 53.09,11.01 R4.1
N$24
  Top 0.61: R51.1 31.49,10.5 30.84,11.16 30.84,11.17 30.83,11.18 30.83,13.34 | 30.83,13.34 30.83,13.84 | 30.83,13.84 30.83,14.48 31.59,15.24 C55.2 | R46.2 30.53,13.55 | 30.53,13.55 30.83,13.84 | 30.53,13.55 30.75,13.34 30.83,13.34
N$25
  Top 0.305: 57.84,13.97 R6.1 57.84,14.32
  Top 0.406: 57.84,14.08 57.84,13.97 57.75,14.06 | D3.A 57.75,14.14 R6.1 | D2.K 56.74,16.26 57.84,15.15 57.84,14.32
N$26
  Top 0.406: IC7.5 39.99,9.63 40.31,9.31 R5.2
N$27
  Top 0.61: LED1.A 58.53,26.42 R1.1
N$28
  Top 0.305: IC4.2 19.07,25.73 18.72,26.07 R31.1
  Top 0.61: R31.1 17.02,26.92 16.69,26.92 R26.2
N$31
  Top 0.305: IC1.5 56.95,10.2 57.17,9.98 | 57.17,9.98 57.24,9.91 57.54,9.91 57.84,9.61 | D3.K 57.17,9.98
  Top 0.406: 57.75,8.22 C8.1 | IC2.1 59.29,9.98
  Top 0.61: IC2.1 58.26,10.03 | C8.1 57.84,9.61 58.26,10.03 | 58.26,10.03 57.93,10.03
N$32
  Top 0.305: IC3.5 23.99,9.89 24.57,9.31 R37.2
  Top 0.813: R37.2 C41.2
N$33
  Top 0.305: IC3.6 24.97,10.85 R43.1
  Top 0.813: R43.1 R39.2
N$35
  Top 0.813: R9.2 C8.2
N$36
  Top 0.152: 33.75,10.5 33.54,10.5
  Top 0.305: C54.2 34.47,10.5 34.82,10.85 IC7.3
  Top 0.61: 33.75,10.5 C54.2 32.98,9.61 32.65,9.61 32.61,9.57 32.61,9.56 R51.2
N$38  (via drill 0.4)
  Top 0.305: IC3.8 22.99,12.15 23.08,12.19 v22.83,12.19
  Top 0.61: v22.83,16 C19.+
  Top 0.813: C19.+ 25.49,16 | 25.49,16 C17.2 | R20.2 25.91,15.58 25.49,16
  Bottom 0.61: v22.83,12.19 v22.83,16
N$39
  Top 0.406: 62.24,14.57 R36.2
  Top 0.508: IC2.6 59.34,13.14 59.19,13.3 C36.2
  Top 0.813: C36.2 59.19,14.99 | 59.19,14.99 59.19,15.38 C37.+ | 59.19,14.99 59.53,15.33 61.7,15.33 62.24,14.79 R36.2
N$40
  Top 0.406: R10.2 IC2.2
N$41
  Top 0.813: C26.1 R26.1
N$42
  Top 0.406: IC6.1 51.89,26.94 51.57,27.27 C39.2
  Top 0.61: C39.2 51.57,28.53 R40.2
  Top 0.813: R40.2 C42.+
N$43
  Top 0.406: R38.2 24.31,23.53 23.99,23.86 IC4.5
N$44
  Top 0.406: IC6.4 51.89,23.89 52.16,23.62 53.69,23.62 53.94,23.37 53.94,22.61 | C40.1 53.78,22.1 53.94,22.1
  Top 0.813: C40.1 53.94,22.61 | 53.94,22.61 R41.1 54.45,22.61 53.94,22.1 | C43.- 54.45,20.57 53.94,21.08 53.94,22.1 | 53.94,22.1 53.94,22.61
N$45
  Top 0.406: IC5.1 35.89,26.94 35.57,27.27 C46.2
  Top 0.813: R44.2 35.57,28.7 | 35.57,28.7 C46.2 C48.+ 35.06,28.19 35.57,28.7
N$46
  Top 0.406: IC5.4 35.89,23.86 35.57,23.53 C47.1
  Top 0.61: R45.1 34.89,20.57 34.64,20.83 34.64,21.82 | 34.64,21.82 34.64,22.61 | C49.- 34.64,21.82 | C47.1 34.78,21.82 34.64,21.82
  Top 0.813: C47.1 34.64,22.61 C49.-
N$49
  Top 0.305: R59.1 34.73,11.85 35.08,11.5 IC7.2
  Top 0.508: R59.1 R56.2
N$51  (via drill 0.4)
  Top 0.406: 19.91,27.24 19.89,27.22 19.89,26.92 | 19.89,26.92 IC4.1 19.89,26.77 20.35,27.24 | 19.4,27.24 19.57,27.24 19.89,26.92
  Top 0.61: R35.1 19.56,29.88 18.83,29.15 18.82,29.15 18.56,28.88 18.56,28.19 | 18.56,27.51 18.82,27.24 19.4,27.24 19.91,27.24 20.35,27.24 v20.41,27.18 | 18.56,27.51 18.56,28.19 | 18.56,28.19 18.14,27.77 R31.2 18.29,27.77 18.56,27.51
  Top 0.813: R54.1 v29.39,24.55
  Bottom 0.813: v29.39,24.55 29.39,25.12 27.69,26.83 27.43,27.08 27.34,27.18 v20.41,27.18
N$52
  Top 0.305: IC4.3 19.07,25.08 18.72,24.73 R30.2
N$53
  Top 0.61: C38.2 20.41,29.04 20.41,29.38 20.46,29.42 R35.2
N$54
  Top 0.305: C45.2 25.33,24.55 24.8,25.08 IC4.6 23.02,25.08 22.7,25.4 22.7,26.42 22.19,26.92 21.68,26.92 21.26,27.34 C38.1
  Top 0.813: C45.2 R42.1
N$55  (via drill 0.4)
  Top 0.305: C45.1 25.33,26.25 24.8,25.73 IC4.7
  Top 0.813: C45.1 R42.2 v30.99,26.25 | v46.83,24.13 R55.1
  Bottom 0.813: v46.83,24.13 46.83,27.94 44.54,30.23 33.11,30.23 30.99,28.11 v30.99,26.25
N$56
  Top 0.305: IC5.2 35.08,25.73 34.55,26.25 R54.2
N$57
  Top 0.305: R52.2 50.64,26.16 51.08,25.73 IC6.2 53.76,25.73 54.62,26.58 R57.1
N$58
  Top 0.61: C53.+ 47.08,28.19 47.85,27.43 47.85,27.52 R49.2 | C51.1 48.01,29.72 47.85,29.72
  Top 0.813: R50.1 47.59,30.23 | 47.59,30.23 47.85,30.23 | 47.85,30.23 C51.1 | C53.+ 47.85,28.19 | 47.85,28.19 R49.2 | R52.1 47.85,26.84 47.85,27.43 47.85,28.19 | 47.85,28.19 47.85,29.72 | 47.85,29.72 47.85,30.23 | 47.85,29.72 47.59,29.97 47.59,30.23
N$59
  Top 0.305: IC5.3 38.16,25.08 | 38.16,25.08 38.61,25.53 | 38.16,25.08 38.34,24.89 38.61,24.89
  Top 0.813: R53.2 38.61,24.89 38.61,25.53 R58.1
N$60
  Top 0.406: IC5.8 39.99,26.94 40.31,27.27 R58.2
N$61
  Top 0.305: R55.2 51.16,25.08 IC6.3
N$62
  Top 0.406: IC4.8 23.99,26.94 24.31,27.27 C32.2
  Top 0.813: C32.2 24.31,28.7 | 24.31,28.7 R32.2 | C34.+ 24.82,28.19 24.31,28.7
N$63
  Top 0.61: R48.1 40.99,21.25 | C50.1 40.99,21.25 | 40.99,21.25 40.99,21.34 | R47.2 41.15,22.1 40.99,22.1 40.82,22.1 R53.1 40.82,23.11 40.99,23.11 41.15,23.11 R47.2
  Top 0.813: R53.1 40.99,22.61 | 40.99,22.61 R47.2 | R48.1 40.99,20.57 | 40.99,20.57 C50.1 | 40.99,20.57 40.99,21.34 40.99,22.1 40.99,22.61 | 40.99,22.61 40.99,23.11 40.99,23.83 41.77,24.62 C52.+
N$64
  Top 0.406: IC4.4 19.89,23.6 19.56,23.28 C33.1
  Top 0.813: 19.56,21.84 R33.1 19.56,20.83 19.06,21.34 | 19.56,21.84 C33.1 | C35.- 19.06,21.34 | 19.06,21.34 19.56,21.84
N$99
  Top 0.305: IC3.7 25.48,11.5 R43.2
  Top 0.813: C44.1 24.57,13.25 24.95,12.86 25.37,12.86 | 25.37,12.86 25.49,12.86 | 25.75,12.48 R43.2 25.75,12.61 25.49,12.86 | 25.49,12.86 26,12.86 | 26,12.86 28.63,12.86 29.65,11.85 R46.1 | 25.75,12.48 25.37,12.86 | 25.75,12.48 26,12.73 26,12.86
PULSE_DURATION  (via drill 0.4)
  Top 0.305: IC5.7 41.06,25.73 v41.5,26.16
  Top 0.813: v65.88,17.53 69.18,17.53 | 69.18,17.53 70.06,17.53 | X3.3 X3.7 69.17,17.54 69.18,17.53
  Bottom 0.813: 65.21,17.53 v65.88,17.53 62.07,17.53 58.51,21.08 43.02,21.08 41.5,22.61 v41.5,26.16
RESET
  Top 0.61: IC2.4 64.49,12.33 65.37,13.21 65.37,15.24 66.17,16.04 X3.8
  Top 0.813: X3.8 X3.4
RISING_SLOPE  (via drill 0.4)
  Top 0.305: 57.17,25.73 IC6.7
  Top 0.406: 57.24,25.91 57.17,25.84 57.17,25.73
  Top 0.813: v57.75,25.4 57.24,25.91 57.24,27.27 R57.2 | X3.2 X3.6 65.94,19.04 v65.92,19.03
  Bottom 0.813: v57.75,25.4 57.75,24.13 62.86,19.03 v65.92,19.03
SIGNAL_INPUT
  Top 0.813: A1.ANT R19.1

### Text on the board
tNames: GAMMA PIN semiconductor radiation detector: / Signal processing board | OUT / FLTR SIG | IN SIG | OUT TO ADC | Marcin Wachowiak, Poland 16.11.2019
bNames: +65V | +65V | +5V | +5V | GND | GND | -5V | -5V | GND | +SLOPE | OUT AMPL / /FLTR SIG | PULSE DUR | S&H RESET | IN SIG | OUT TO ADC